# EAGLE design drive_board5 (EAGLE 6.1)
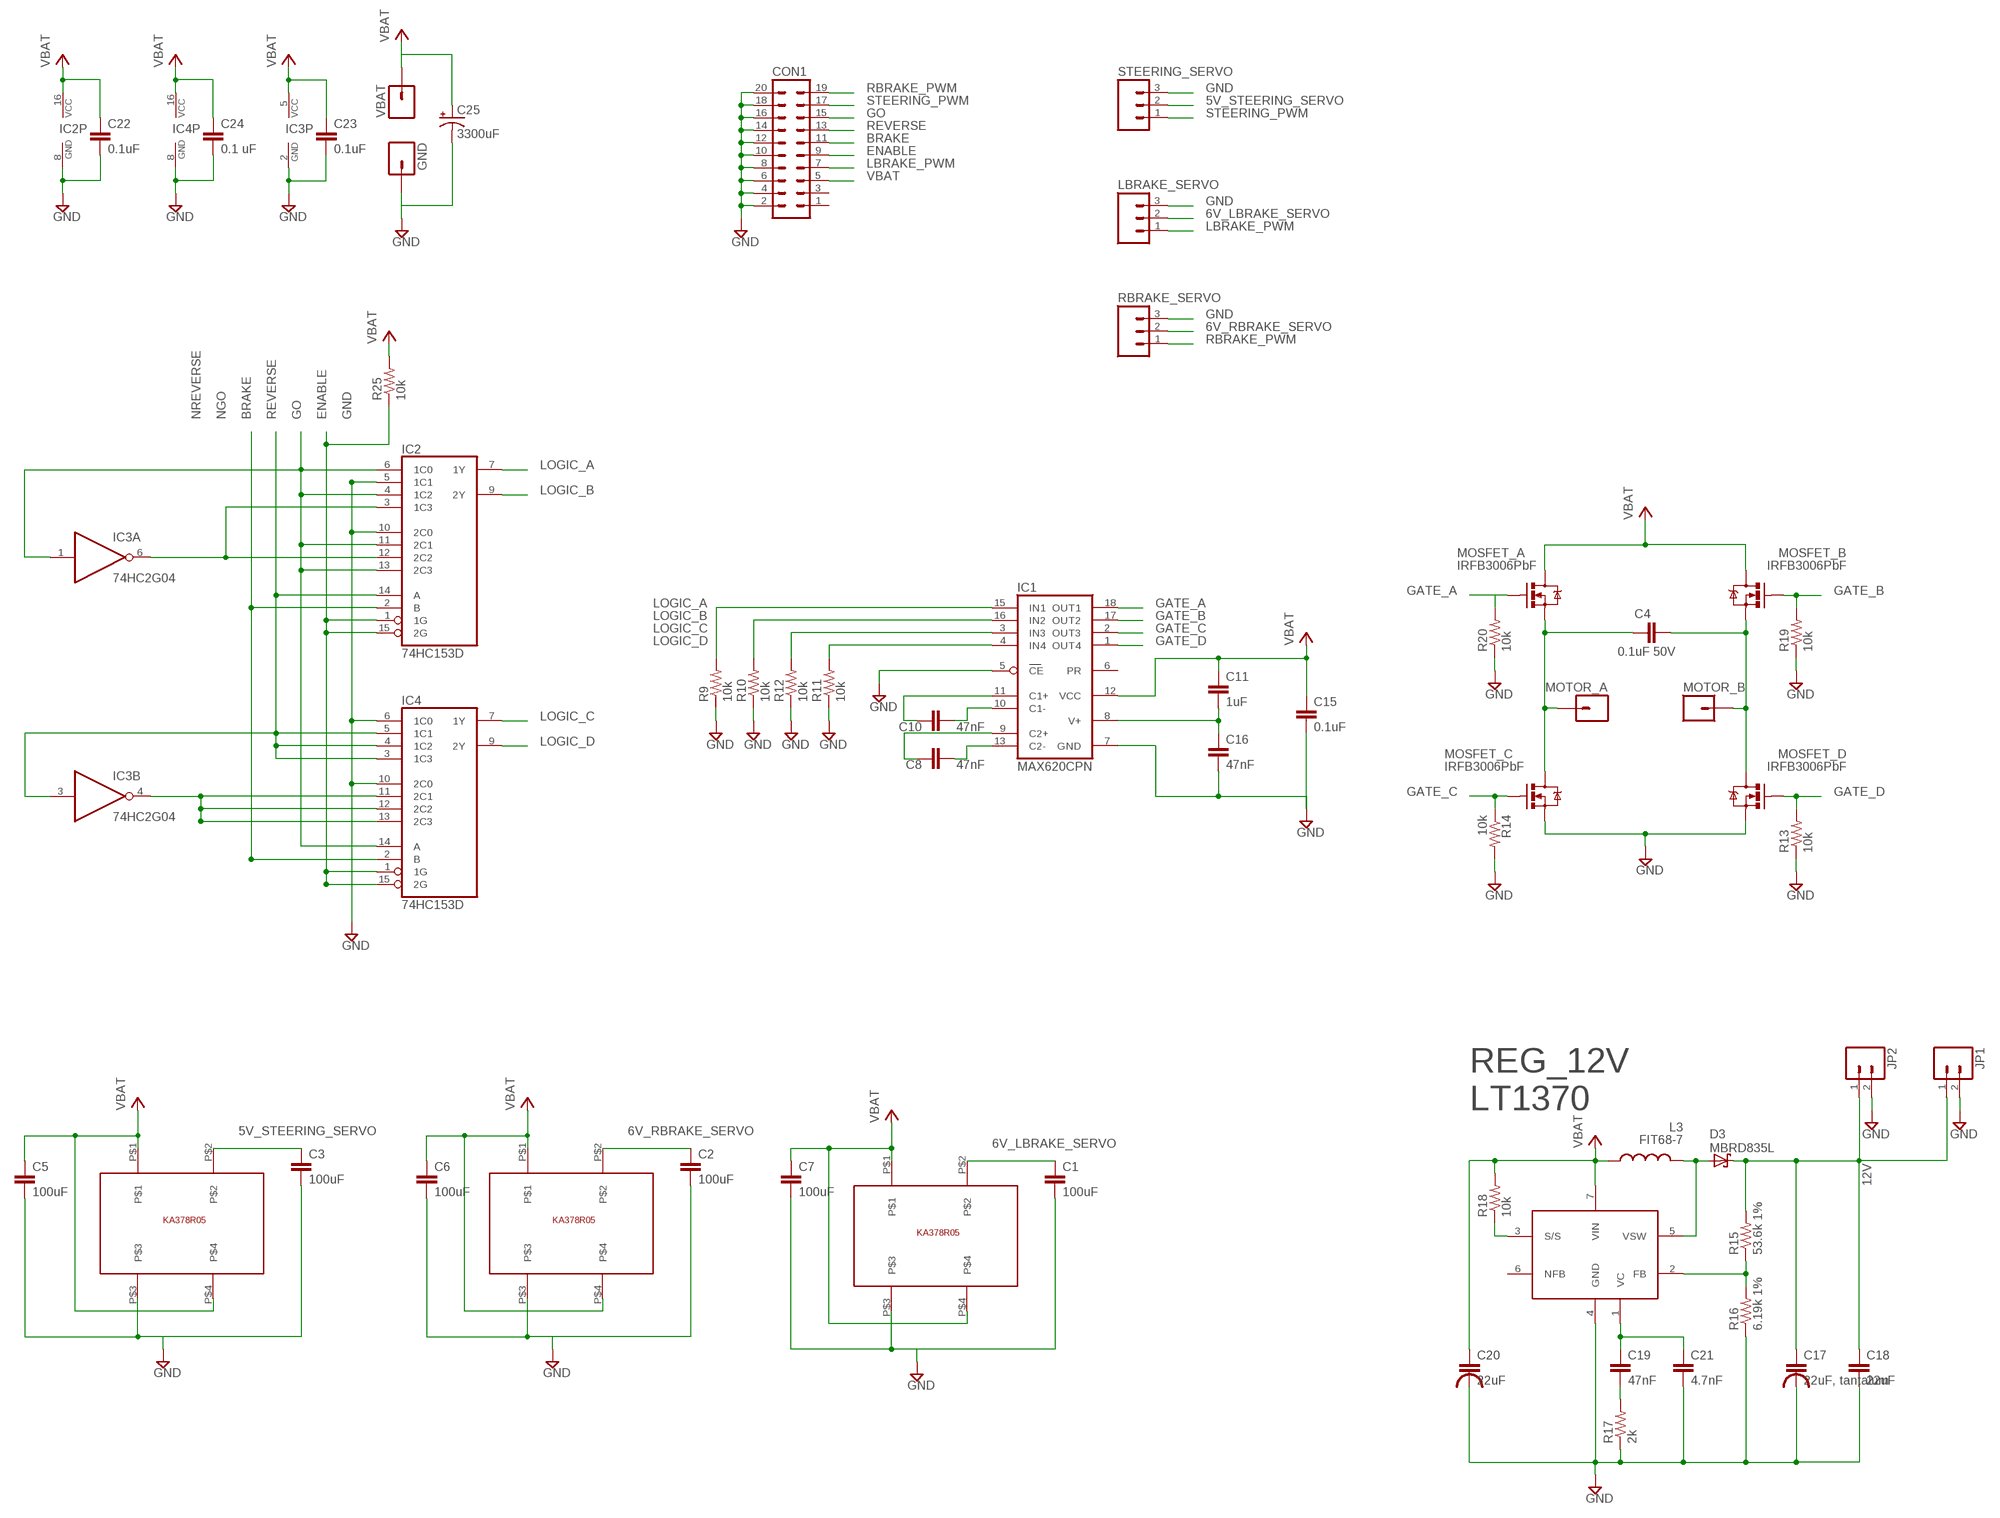
[diagram p0: schematic, sheet 1]

## Parts
C1  100uF  CAP0603-CAP  [0603-CAP]
C2  100uF  CAP0603-CAP  [0603-CAP]
C3  100uF  CAP0603-CAP  [0603-CAP]
C4  0.1uF 50V  CAP0603-CAP  [0603-CAP]
C5  100uF  CAP0603-CAP  [0603-CAP]
C6  100uF  CAP0603-CAP  [0603-CAP]
C7  100uF  CAP0603-CAP  [0603-CAP]
C8  47nF  CAP0603-CAP  [0603-CAP]
C10  47nF  CAP0603-CAP  [0603-CAP]
C11  1uF  CAP0603-CAP  [0603-CAP]
C15  0.1uF  CAP0603-CAP  [0603-CAP]
C16  47nF  CAP0603-CAP  [0603-CAP]
C17  22uF, tantalum  TPSD226M025R0200  [CAPACITOR_CASE_D]
C18  22uF  CAP0603-CAP  [0603-CAP]
C19  47nF  CAP0603-CAP  [0603-CAP]
C20  22uF  TPSD226M025R0200  [CAPACITOR_CASE_D]
C21  4.7nF  CAP0603-CAP  [0603-CAP]
C22  0.1uF  CAP0603-CAP  [0603-CAP]
C23  0.1uF  CAP0603-CAP  [0603-CAP]
C24  0.1 uF  CAP0603-CAP  [0603-CAP]
C25  3300uF  CAP_POLPTH1  [CPOL-RADIAL-100UF-25V]
CON1  ML20  [ML20]
D3  MBRD835L  [DPACK_1]
GND  GND  PAD_12GAPTH  [PAD_12GA]
IC1  MAX620CPN  [DIL18]
IC2  74HC153D  [SO16]
IC3  74HC2G04  [TSSOP6]
IC4  74HC153D  [SO16]
JP1  M025MM  [SCREWTERMINAL-5MM-2]
JP2  M025MM  [SCREWTERMINAL-5MM-2]
L3  FIT68-7  INDUCTOR  [TOROID_INDUCTOR]
LBRAKE_SERVO  M03POLAR  [MOLEX-1X3]
MOSFET_A  IRFB3006PbF  MOSFET-NCHANNELPTH2  [TO220V]
MOSFET_B  IRFB3006PbF  MOSFET-NCHANNELPTH2  [TO220V]
MOSFET_C  IRFB3006PbF  MOSFET-NCHANNELPTH2  [TO220V]
MOSFET_D  IRFB3006PbF  MOSFET-NCHANNELPTH2  [TO220V]
MOTOR_A  MOTOR A  PAD_12GAPTH  [PAD_12GA]
MOTOR_B  MOTOR B  PAD_12GAPTH  [PAD_12GA]
R9  10k  RESISTOR0603-RES  [0603-RES]
R10  10k  RESISTOR0603-RES  [0603-RES]
R11  10k  RESISTOR0603-RES  [0603-RES]
R12  10k  RESISTOR0603-RES  [0603-RES]
R13  10k  RESISTOR0603-RES  [0603-RES]
R14  10k  RESISTOR0603-RES  [0603-RES]
R15  53.6k 1%  RESISTOR0603-RES  [0603-RES]
R16  6.19k 1%  RESISTOR0603-RES  [0603-RES]
R17  2k  RESISTOR0603-RES  [0603-RES]
R18  10k  RESISTOR0603-RES  [0603-RES]
R19  10k  RESISTOR0603-RES  [0603-RES]
R20  10k  RESISTOR0603-RES  [0603-RES]
R25  10k  RESISTOR0603-RES  [0603-RES]
RBRAKE_SERVO  M03POLAR  [MOLEX-1X3]
REG_12V  LT1370  [TO220-7]
STEERING_SERVO  M03POLAR  [MOLEX-1X3]
U$5  KA378R05  [TO-220-4L]
U$6  KA378R05  [TO-220-4L]
U$7  KA378R05  [TO-220-4L]
VBAT  7.2V  PAD_12GAPTH  [PAD_12GA]

## Nets
5V_STEERING_SERVO: C3.1 STEERING_SERVO.2 U$7.P$2
6V_LBRAKE_SERVO: C1.1 LBRAKE_SERVO.2 U$5.P$2
6V_RBRAKE_SERVO: C2.1 RBRAKE_SERVO.2 U$6.P$2
12V: C17.P$1 C18.1 D3.C JP1.1 JP2.1 R15.2
BRAKE: CON1.11 IC2.2(B) IC4.2(B)
ENABLE: CON1.9 IC2.1(1G) IC2.15(2G) IC4.1(1G) IC4.15(2G) R25.1
GATE_A: IC1.18(OUT1) MOSFET_A.1(G) R20.2
GATE_B: IC1.17(OUT2) MOSFET_B.1(G) R19.2
GATE_C: IC1.2(OUT3) MOSFET_C.1(G) R14.1
GATE_D: IC1.1(OUT4) MOSFET_D.1(G) R13.2
GND: C1.2 C2.2 C3.2 C5.2 C6.2 C7.2 C15.2 C16.2 C17.P$2 C18.2 C20.P$2 C21.2 C22.2 C23.2 C24.2 C25.2(-) CON1.2 CON1.4 CON1.6 CON1.8 CON1.10 CON1.12 CON1.14 CON1.16 CON1.18 CON1.20 GND.1 IC1.5(CE) IC1.7(GND) IC2.5(1C1) IC2.8(GND) IC2.10(2C0) IC3.2(P:GND) IC4.6(1C0) IC4.8(GND) IC4.10(2C0) JP1.2 JP2.2 LBRAKE_SERVO.3 MOSFET_C.3(S) MOSFET_D.3(S) R9.1 R10.1 R11.1 R12.1 R13.1 R14.2 R16.1 R17.1 R19.1 R20.1 RBRAKE_SERVO.3 REG_12V.4(GND) STEERING_SERVO.3 U$5.P$3 U$6.P$3 U$7.P$3
GO: CON1.15 IC2.4(1C2) IC2.6(1C0) IC2.11(2C1) IC2.13(2C3) IC3.1(A:I) IC4.14(A)
LBRAKE_PWM: CON1.7 LBRAKE_SERVO.1
LOGIC_A: IC1.15(IN1) IC2.7(1Y) R9.2
LOGIC_B: IC1.16(IN2) IC2.9(2Y) R10.2
LOGIC_C: IC1.3(IN3) IC4.7(1Y) R12.2
LOGIC_D: IC1.4(IN4) IC4.9(2Y) R11.2
MOTOR_A: C4.1 MOSFET_A.3(S) MOSFET_C.2(D) MOTOR_A.1
MOTOR_B: C4.2 MOSFET_B.3(S) MOSFET_D.2(D) MOTOR_B.1
N$1: C10.1 IC1.11(C1+)
N$2: C10.2 IC1.10(C1-)
N$3: C8.2 IC1.13(C2-)
N$4: C8.1 IC1.9(C2+)
N$20: D3.B(A) D3.E(A) L3.2 REG_12V.5(VSW)
N$21: R15.1 R16.2 REG_12V.2(FB)
N$22: C19.1 C21.1 REG_12V.1(VC)
N$23: C19.2 R17.2
N$24: R18.1 REG_12V.3(S/S)
NGO: IC2.3(1C3) IC2.12(2C2) IC3.6(A:O)
NREVERSE: IC3.4(B:O) IC4.11(2C1) IC4.12(2C2) IC4.13(2C3)
RBRAKE_PWM: CON1.19 RBRAKE_SERVO.1
REVERSE: CON1.13 IC2.14(A) IC3.3(B:I) IC4.3(1C3) IC4.4(1C2) IC4.5(1C1)
STEERING_PWM: CON1.17 STEERING_SERVO.1
V+: C11.2 C16.1 IC1.8(V+)
VBAT: C5.1 C6.1 C7.1 C11.1 C15.1 C20.P$1 C22.1 C23.1 C24.1 C25.1(+) CON1.5 IC1.12(VCC) IC2.16(VCC) IC3.5(P:VCC) IC4.16(VCC) L3.1 MOSFET_A.2(D) MOSFET_B.2(D) R18.2 REG_12V.7(VIN) U$5.P$1 U$5.P$4 U$6.P$1 U$6.P$4 U$7.P$1 U$7.P$4 VBAT.1
VCC: R25.2 ; supply symbol labelled VBAT
Unconnected: CON1.1 CON1.3 IC1.6(PR) REG_12V.6(NFB)

## Notes on the sheet
- 5V_STEERING_SERVO | 6V_RBRAKE_SERVO
- 6V_LBRAKE_SERVO

## Library data of the parts
C1-C3 C5-C7 C18 C22-C24 = SparkFun-Passives:CAP: Capacitor Standard 0603 ceramic capacitor, and 0.1" leaded capacitor.
C4 C8 C10 C11 C15 C16 C19 C21 = SparkFun:CAP: Capacitor Standard 0603 ceramic capacitor, and 0.1" leaded capacitor.
C17 C20 = group10:TPSD226M025R0200
C25 = SparkFun-Passives:CAP_POL: Capacitor Polarized These are standard SMD and PTH capacitors. Normally 10uF, 47uF, and 100uF in electrolytic and tantalum varieties. Always verify the external diameter of the through hole cap, it varies with capacity, voltage, and manufacturer. The EIA devices should be standard.
CON1 = con-harting-ml:ML20: HARTING; OC_FARNELL: unknown; OC_NEWARK: unknown
D3 = group10:MBRD835L
GND MOTOR_A MOTOR_B VBAT = group10:PAD_12GA: Header 1 Standard 1-pin 0.1" header. Use with straight break away headers (SKU : PRT-00116), right angle break away headers (PRT-00553), swiss pins (PRT-00743), machine pins (PRT-00117), and female headers (PRT-00115).
IC1 = maxim:MAX620CPN: MOSFET DRIVER; MPN: MAX620CPN+; OC_FARNELL: unknown; OC_NEWARK: 27M4142
IC2 IC4 = 74xx-eu:74*153: Dual 4-line to 1-line data SELECTOR/MULTIPLEXER
IC3 = group10:74HC2G04
JP1 JP2 = SparkFun-Connectors:M02: Header 2 Standard 2-pin 0.1" header. Use with straight break away headers (SKU : PRT-00116), right angle break away headers (PRT-00553), swiss pins (PRT-00743), machine pins (PRT-00117), and female headers (PRT-00115). Molex polarized connector foot print use with SKU : PRT-08233 with associated crimp pins and housings.
L3 = group10:INDUCTOR: Inductors Basic Inductor/Choke - 0603 and 1206. Footprints are not proven and vary greatly between part numbers.
LBRAKE_SERVO RBRAKE_SERVO STEERING_SERVO = SparkFun-Connectors:M03: Header 3 Standard 3-pin 0.1" header. Use with straight break away headers (SKU : PRT-00116), right angle break away headers (PRT-00553), swiss pins (PRT-00743), machine pins (PRT-00117), and female headers (PRT-00115). Molex polarized connector foot print use with SKU : PRT-08232 with associated crimp pins and housings.
MOSFET_A MOSFET_B MOSFET_C MOSFET_D = group10:MOSFET-NCHANNEL: Generic NMOS footprint
R9-R20 R25 = SparkFun:RESISTOR: Resistor Basic schematic elements and footprints for 0603, 1206, and PTH resistors.
REG_12V = group10:LT1370
U$5-U$7 = group10:KA378R05

## Board
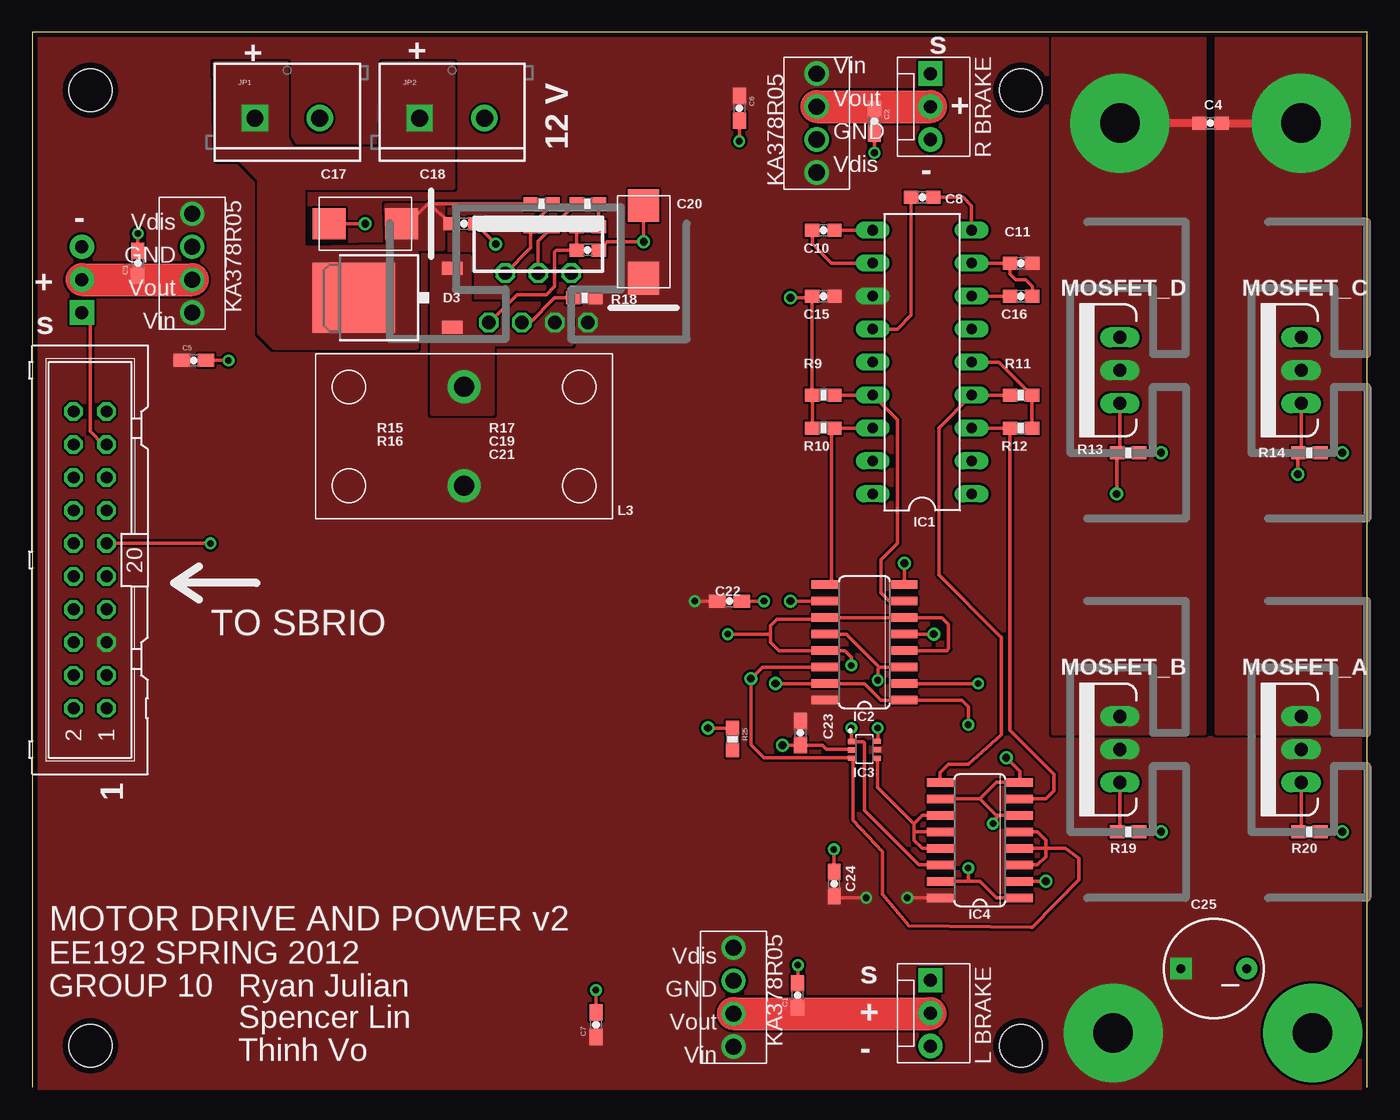
[diagram p1: board, top side]
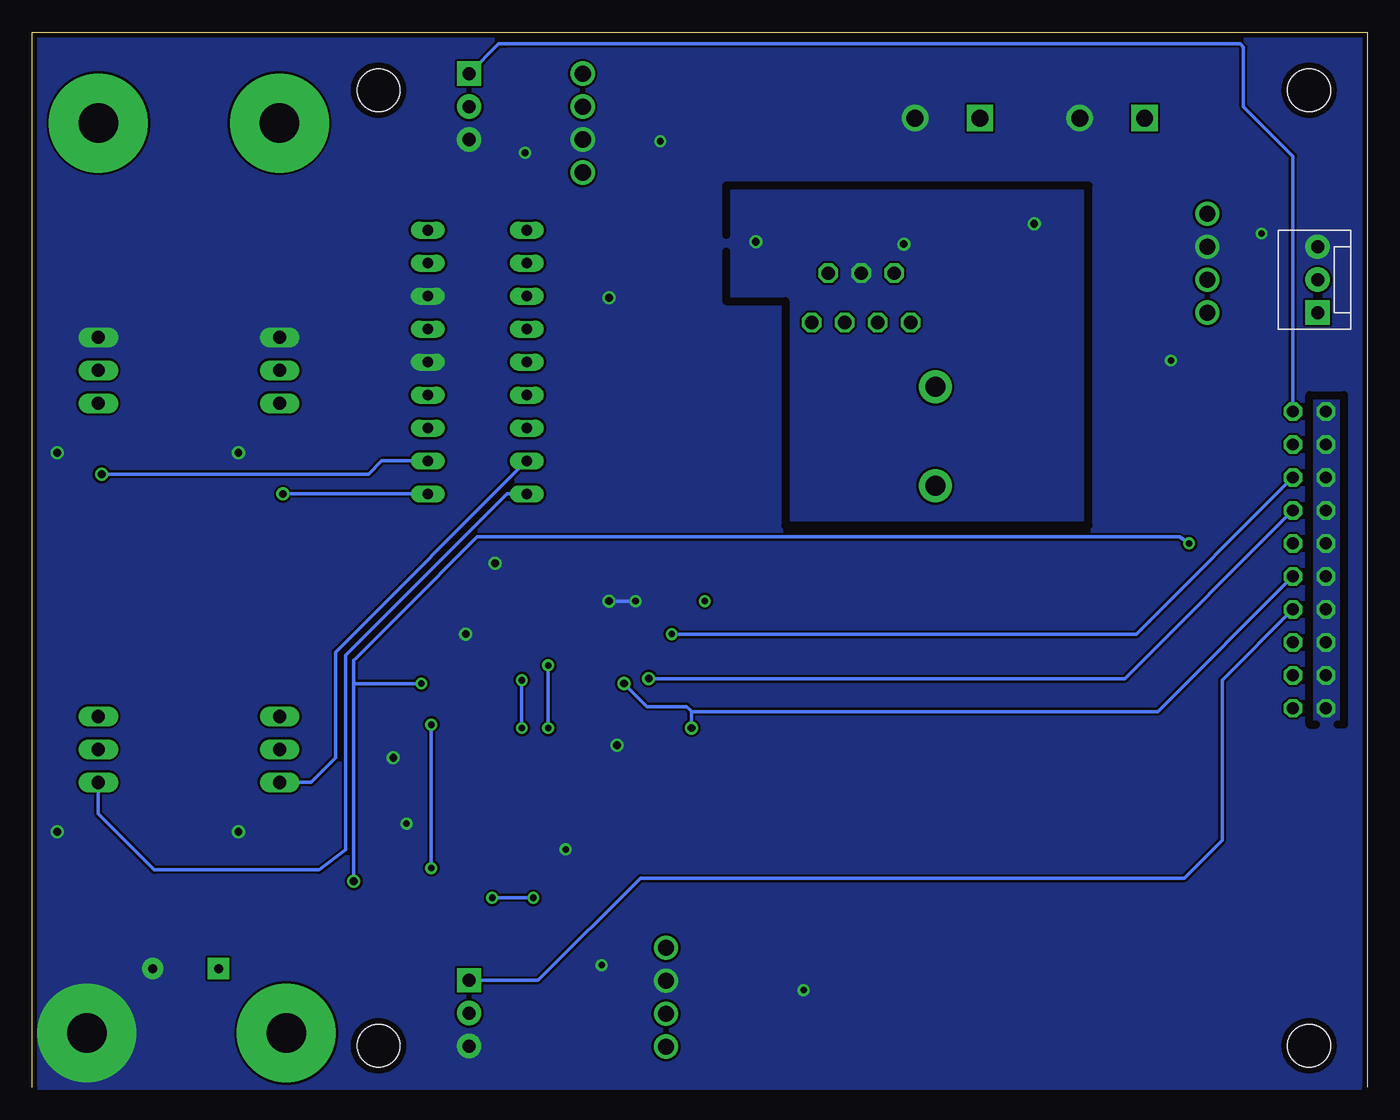
[diagram p2: board, bottom side, seen from below]

Size 102.87 x 81.28 mm. Coordinates in mm from the lower left corner, seen from the top.
Outline: 102.87,0 102.87,81.28 0,81.28 0,0
Copper layers (1*16): Top 0.035559375mm / dielectric 1.501140625mm / Bottom 0.035559375mm
Design rules: minimum track width 10mil, minimum drill 15mil, track to track 6mil, track to pad 6mil, pad to pad 6mil, via to via 6mil, smd to smd 6mil, copper to edge 15mil, drill to drill 8mil, minimum pad ring 10mil, minimum via ring 8mil, stop-mask expansion 4mil, vias tented up to drill 0mil, thermal gap 10mil
bRestrict: 12 lines

### Footprints (pad centres in the part's own frame; a part is rotated, then mirrored left to right if it is on the bottom)
0603-CAP = smd 1.27 x 1: 1 -0.934,0; 2 0.934,0
0603-CAP' = smd 1.1 x 1: 1 -0.85,0; 2 0.85,0
CAPACITOR_CASE_D = smd 2.54 x 2.388: P$1 -2.794,0; P$2 2.794,0
CPOL-RADIAL-100UF-25V = drill 0.7 pad 1.651 square: 1 2.54,0 | drill 0.7 pad 1.651: 2 -2.54,0
ML20 = drill 0.914 octagon: 1 -11.43,-1.27; 2 -11.43,1.27; 3 -8.89,-1.27; 4 -8.89,1.27; 5 -6.35,-1.27; 6 -6.35,1.27; 7 -3.81,-1.27; 8 -3.81,1.27; 9 -1.27,-1.27; 10 -1.27,1.27; 11 1.27,-1.27; 12 1.27,1.27; 13 3.81,-1.27; 14 3.81,1.27; 15 6.35,-1.27; 16 6.35,1.27; 17 8.89,-1.27; 18 8.89,1.27; 19 11.43,-1.27; 20 11.43,1.27
DPACK_1 = smd 1 x 1.6: B -2.28,-6.07; E 2.28,-6.07 | smd 5.4 x 6.35: C 0,1.524
PAD_12GA = drill 3.048 pad 7.62: 1 0,0
DIL18 = drill 0.813 long: 1 -10.16,-3.81; 2 -7.62,-3.81; 3 -5.08,-3.81; 4 -2.54,-3.81; 5 0,-3.81; 6 2.54,-3.81; 7 5.08,-3.81; 8 7.62,-3.81; 9 10.16,-3.81; 10 10.16,3.81; 11 7.62,3.81; 12 5.08,3.81; 13 2.54,3.81; 14 0,3.81; 15 -2.54,3.81; 16 -5.08,3.81; 17 -7.62,3.81; 18 -10.16,3.81
SO16 = smd 0.66 x 2.032: 1 -4.445,-3.073; 2 -3.175,-3.073; 3 -1.905,-3.073; 4 -0.635,-3.073; 5 0.635,-3.073; 6 1.905,-3.073; 7 3.175,-3.073; 8 4.445,-3.073; 9 4.445,3.073; 10 3.175,3.073; 11 1.905,3.073; 12 0.635,3.073; 13 -0.635,3.073; 14 -1.905,3.073; 15 -3.175,3.073; 16 -4.445,3.073
TSSOP6 = smd 0.55 x 0.4: 1 -0.99,0.61; 2 -0.99,-0.04; 3 -0.99,-0.69; 4 0.99,-0.69; 5 0.99,-0.015; 6 0.99,0.62
SCREWTERMINAL-5MM-2 = drill 1.3 pad 2.032 square: 1 0,0 | drill 1.3 pad 2.032: 2 5,0
TOROID_INDUCTOR = drill 1.524 pad 2.54: 1 0,3.81; 2 0,-3.81
MOLEX-1X3 = drill 1.016 pad 1.88 square: 1 0,0 | drill 1.016 pad 1.88: 2 2.54,0; 3 5.08,0
TO220V = drill 1.016 long: 1 -2.54,0; 2 0,0; 3 2.54,0
0603-RES = smd 1.1 x 1: 1 -0.85,0; 2 0.85,0
TO220-7 = drill 1.016 octagon: 1 -3.81,3.81; 2 0,2.54; 3 -3.81,1.27; 4 0,0; 5 -3.81,-1.27; 6 0,-2.54; 7 -3.81,-3.81
STAND-OFF = hole 3.302: 0,0
TO-220-4L = drill 1.25: P$1 -3.81,0; P$2 -1.27,0; P$3 1.27,0; P$4 3.81,0

### Placement (x,y rotation side)
C1  58.98,7.09 90 top
C2  64.9,74.42 270 top
C3  8.13,63.5 90 top
C4  0.1uF 50V  [0603-CAP']  90.81,74.3 180 top
C5  12.45,56.01 0 top
C6  54.48,75.44 270 top
C7  43.43,4.83 90 top
C8  47nF  [0603-CAP']  68.58,68.58 180 top
C10  47nF  [0603-CAP']  60.96,66.04 0 top
C11  1uF  [0603-CAP']  76.2,63.5 180 top
C15  0.1uF  [0603-CAP']  60.96,60.96 180 top
C16  47nF  [0603-CAP']  76.2,60.96 180 top
C17  25.65,66.55 180 top
C18  33.27,66.55 0 top
C19  47nF  [0603-CAP']  42.8,66.29 0 top
C20  47.12,65.15 90 top
C21  4.7nF  [0603-CAP']  42.8,64.52 0 top
C22  53.72,37.47 0 top
C23  59.18,27.3 270 top
C24  61.8,15.67 90 top
C25  91.06,9.14 180 top
CON1  4.45,40.64 90 top
D3  26.29,60.83 90 top
GND  98.68,4.19 0 top
IC1  68.58,55.88 90 top
IC2  64.14,34.29 90 top
IC3  64.14,26.04 0 top
IC4  73.03,19.05 90 top
JP1  17.14,74.68 0 top
JP2  29.84,74.68 0 top
L3  33.27,50.16 180 top
LBRAKE_SERVO  69.22,8.26 270 top
MOSFET_A  97.79,26.04 90 top
MOSFET_B  83.82,26.04 90 top
MOSFET_C  97.79,55.24 90 top
MOSFET_D  83.82,55.24 90 top
MOTOR_A  97.79,74.3 0 top
MOTOR_B  83.82,74.3 0 top
R9  60.96,53.34 0 top
R10  60.96,50.8 0 top
R11  76.2,53.34 180 top
R12  76.2,50.8 180 top
R13  84.45,48.9 180 top
R14  98.42,48.9 0 top
R15  39.24,68.07 180 top
R16  39.24,66.29 180 top
R17  42.8,68.07 0 top
R18  42.55,60.83 0 top
R19  84.45,19.68 180 top
R20  98.42,19.68 180 top
R25  53.97,26.83 270 top
RBRAKE_SERVO  69.22,78.11 270 top
REG_12V  38.99,62.74 90 top
STEERING_SERVO  3.81,59.69 90 bottom
U$1  [STAND-OFF]  4.47,76.83 0 top
U$2  [STAND-OFF]  76.2,76.83 0 top
U$3  [STAND-OFF]  4.47,3.2 0 top
U$4  [STAND-OFF]  76.2,3.2 0 top
U$5  54.03,6.95 90 top
U$6  60.45,74.3 270 top
U$7  12.32,63.5 90 top
VBAT  83.31,4.19 0 top

### Tracks (layer width: path | path; a pad name or v marks a point on that pad's centre or on a via)
5V_STEERING_SERVO
  Top 0.254: C3.1 11.98,62.57 U$7.P$2
  Top 2.54: STEERING_SERVO.2 U$7.P$2
6V_LBRAKE_SERVO
  Top 0.254: 69.18,5.68 LBRAKE_SERVO.2 | C1.1 58.93,6.1 | 58.93,6.1 58.93,5.97 | 58.93,6.1 58.93,5.68
  Top 2.54: U$5.P$2 58.93,5.68 69.18,5.68
6V_RBRAKE_SERVO
  Top 0.254: C2.1 69.01,75.36 RBRAKE_SERVO.2
  Top 2.54: U$6.P$2 RBRAKE_SERVO.2
12V
  Top 0.254: 38.48,68.07 R15.2 30.48,68.07 | 30.48,68.07 C18.1 | C17.P$1 28.96,66.55 30.48,68.07
  pour Top (isolate 0.178, no thermals): 29.59,57.02 18.67,57.02 17.53,58.17 17.53,69.98 16,71.5 14.35,71.5 14.22,71.63 14.1,78.87 19.56,78.87 19.56,73.15 20.07,72.26 26.92,72.26 27.05,77.47 27.05,78.87 32.38,78.87 32.38,69.34 20.95,69.34 20.83,69.22 20.83,64.64 27.43,64.77 27.3,67.94 31.62,67.94 31.62,64.64 29.59,64.64
BRAKE  (via drill 0.51, 0.6)
  Top 0.254: IC4.2 v78.11,15.88 | IC2.2 v72.9,31.11 | v13.72,41.91 CON1.11 5.59,41.91
  Bottom 0.254: 78.11,31.11 78.11,32.89 77.98,33.02 74.42,36.58 68.58,42.42 14.48,42.42 v13.72,41.91 | 78.11,31.11 78.11,16.89 v78.11,15.88 | v72.9,31.11 78.11,31.11
ENABLE  (via drill 0.51, 0.6)
  Top 0.254: IC4.15 72.14,15.88 | 72.14,15.88 73.03,15.88 74.3,14.61 IC4.1 | v57.28,31.11 IC2.15 64.14,31.11 65.41,29.84 IC2.1 71.63,29.84 72.14,29.34 v72.14,27.94 | R25.1 v52.07,27.69 | v72.14,16.89 72.14,15.88
  Bottom 0.254: v72.14,27.94 v72.14,16.89 | v52.07,27.69 52.07,28.96 | 52.07,28.96 52.2,29.08 | 52.2,29.08 52.45,29.34 55.5,29.34 v57.28,31.11 | CON1.9 16.13,28.96 52.07,28.96 | 52.07,28.96 52.2,29.08
GATE_A
  Top 0.254: MOSFET_A.1 97.79,19.68 R20.2
  Bottom 0.254: IC1.18 66.29,45.72 78.74,33.27 78.74,18.29 80.77,16.76 93.47,16.76 97.79,21.08 MOSFET_A.1
GATE_B
  Top 0.254: MOSFET_B.1 83.82,19.68 R19.2
  Bottom 0.254: IC1.17 79.5,33.53 79.5,25.4 81.41,23.5 MOSFET_B.1
GATE_C  (via drill 0.6)
  Top 0.254: MOSFET_C.1 97.79,48.9 R14.1 97.54,48.86 v97.54,47.24
  Bottom 0.254: IC1.2 75.95,48.26 76.96,47.24 v97.54,47.24
GATE_D  (via drill 0.6)
  Top 0.254: MOSFET_D.1 83.82,48.9 R13.2 83.57,48.9 | 83.19,48.9 83.57,48.9 | 83.57,48.9 v83.57,45.72
  Bottom 0.254: IC1.1 v83.57,45.72
GND  (via drill 0.51, 0.6)
  Top 0.254: R13.1 v87,48.9 | R14.2 v100.97,48.9 | R19.1 v87,19.68 | R20.1 v100.97,19.68 | IC2.10 v58.42,37.47 | IC2.8 v67.21,40.39 | IC2.5 v69.47,34.92 | v57.81,26.36 C23.2 60.88,26.37 61.21,26.04 63.1,26.04 IC3.2 | v75.06,25.4 76.1,24.36 IC4.8 74.3,23.5 73.03,22.23 | 73.03,22.23 IC4.10 | 73.03,22.23 74.3,20.95 IC4.6 74.42,20.95 v74.04,20.32 | R10.1 60.11,53.3 60.07,53.34 | 60.07,53.34 60.07,60.83 | 60.07,60.83 v58.42,60.83 | 60.07,60.83 60.07,60.92 C15.2 | IC1.5 74.51,55.88 R11.1 R12.1 | IC1.7 C16.2 | C17.P$2 v25.65,66.55 | C20.P$2 v47.12,65.15 44.28,65.15 C21.2 | C18.2 v35.71,64.97 | REG_12V.4 38.99,65.19 R16.1 41.87,68.07 R17.1 | R9.1 60.07,53.34 | C1.2 59,8.02 v59,9.42 | C22.2 v56.39,37.47 | C24.2 v61.77,18.34 | C3.2 v8.13,65.79 | C2.2 v64.9,72.01 | C6.2 v54.48,72.9 | C5.2 v15.11,56.01 | C7.2 v43.43,7.49
  Bottom 0.254: v59,9.42 v59,9.41 | v56.39,37.47 v58.42,37.47 | v8.13,65.79 8.13,65.66
  pour Bottom (isolate 0.178, rank 6, no thermals): 0,81.28 102.87,81.28 102.87,0 0,0
GO  (via drill 0.51)
  Top 0.254: IC2.4 70.48,33.66 70.61,33.78 70.61,35.69 70.1,36.2 IC2.6 IC2.11 60.96,36.09 60.96,36.07 57.4,36.07 56.9,35.56 56.9,34.92 | v63.12,27.69 63.12,26.64 IC3.1 64.03,26.64 64.14,26.54 64.14,21.34 68.33,17.14 IC4.14 | v63.12,32.51 63.12,33.15 62.61,33.66 IC2.13 57.53,33.66 56.9,34.29 56.9,34.8 56.9,34.92 | v53.59,34.92 56.9,34.92 | IC4.14 69.98,17.14 IC4.14
  Bottom 0.254: v63.12,27.69 v63.12,32.51 | v53.59,34.92 17.78,34.92 CON1.15
LBRAKE_PWM
  Bottom 0.254: LBRAKE_SERVO.1 63.88,8.26 56.01,16.13 14.1,16.13 11.18,19.05 11.18,31.37 CON1.7
LOGIC_A
  Top 0.254: R9.2 IC1.15 66.67,51.44 66.67,41.91 65.41,40.64 65.41,38.1 66.04,37.47 IC2.7
LOGIC_B
  Top 0.254: IC1.16 R10.2 61.59,50.8 61.59,38.73 IC2.9
LOGIC_C
  Top 0.254: IC1.3 R12.2 75.35,27.52 78.74,24.13 78.74,22.86 78.11,22.23 IC4.7
LOGIC_D
  Top 0.254: 75.56,53.34 R11.2 IC1.4 69.85,50.8 69.85,39.5 74.55,34.8 74.68,34.67 74.68,34.54 74.68,27.18 72.14,24.89 70.61,24.89 69.95,24.23 IC4.9
MOTOR_A
  Top 0.61: C4.1 MOTOR_A.1
  pour Top (isolate 0.178, no thermals): 102.87,81.28 91.31,81.28 91.31,27.3 102.87,27.3
MOTOR_B
  Top 0.61: C4.2 83.95,74.3 83.82,74.42
  pour Top (isolate 0.178, no thermals): 90.3,81.28 78.74,81.28 78.74,27.3 90.3,27.3
N$1
  Top 0.254: C10.1 60.11,64.98 61.59,63.5 IC1.11
N$2
  Top 0.254: C10.2 IC1.10
N$3
  Top 0.254: C8.2 67.73,59.48 66.67,58.42 IC1.13
N$4
  Top 0.254: C8.1 71.75,68.58 72.39,67.94 IC1.9
N$20
  pour Top (isolate 0.178, no thermals): 33.66,64.01 30.86,64.01 30.86,51.94 35.43,51.94 35.43,57.28 41.53,57.28 41.53,60.33 33.66,60.33
N$21
  Top 0.254: R15.1 R16.2 38.39,64.68 REG_12V.2
N$22
  Top 0.254: C19.1 C21.1 | C21.1 41.57,64.14 | REG_12V.1 37.34,61.09 39.62,61.09 40.26,61.72 40.26,64.39 40.39,64.52 C21.1
N$23
  Top 0.254: R17.2 C19.2
N$24
  Top 0.254: REG_12V.3 38.35,58.93 40.26,60.83 R18.1
NGO  (via drill 0.51)
  Top 0.254: 67.59,32.26 IC2.3 65.28,32.38 | 65.28,32.38 62.74,34.92 61.09,34.92 IC2.12 | IC3.6 65.15,26.66 v65.15,27.69 | v65.15,31.37 65.15,32.26 65.28,32.38
  Bottom 0.254: v65.15,27.69 v65.15,31.37
NREVERSE
  Top 0.254: IC4.11 68.58,20.95 67.94,20.32 | 67.94,20.32 67.94,19.68 | 67.94,19.68 67.94,19.05 68.58,18.41 IC4.13 | IC4.12 67.94,19.68 | IC3.4 65.12,23.14 67.94,20.32
RBRAKE_PWM
  Bottom 0.254: CON1.19 5.71,71.75 9.53,75.56 9.53,80.14 9.78,80.39 66.42,80.39 66.93,80.39 RBRAKE_SERVO.1
REVERSE  (via drill 0.6)
  Top 0.254: IC4.5 77.47,19.68 78.11,19.05 78.11,18.41 | 78.11,18.41 78.11,17.78 77.47,17.14 IC4.3 | IC4.4 78.11,18.41 | IC2.14 56.26,32.38 v55.37,31.5 55.37,26.42 56.39,25.4 63.09,25.4 IC3.3 63.25,25.24 63.25,20.7 63.25,20.57 65.53,18.16 65.53,14.86 67.56,12.45 76.96,12.32 77.09,12.32 80.64,16 80.64,17.65 79.63,18.41 78.11,18.41
  Bottom 0.254: v55.37,31.5 18.67,31.5 CON1.13
STEERING_PWM
  Top 0.254: STEERING_SERVO.1 4.45,59.05 4.45,50.55 5.46,49.53 CON1.17
V+
  Top 0.254: IC1.8 C11.2 75.35,62.7 75.82,62.23 76.58,62.23 77.09,61.72 77.09,61 C16.1
VBAT  (via drill 0.51)
  Top 0.254: C22.1 v51.05,37.47 | IC4.16 | C24.1 61.72,14.61 v64.26,14.61 | v67.44,14.61 70.1,14.61
  Bottom 0.254: v64.26,14.61 v67.44,14.61
  pour Top (isolate 0.178, rank 2, no thermals): 0,81.28 102.87,81.28 102.87,0 0,0

### Text on the board
tNames: s | + | + | + | 12 V | R BRAKE | - | - | + | s | TO SBRIO | 1 | MOTOR DRIVE AND POWER v2 | EE192 SPRING 2012 | s | GROUP 10 | Ryan Julian | Spencer Lin | + | Thinh Vo | - | L BRAKE